# Altium schematic sheet led_ext_board.SchDoc
size A3
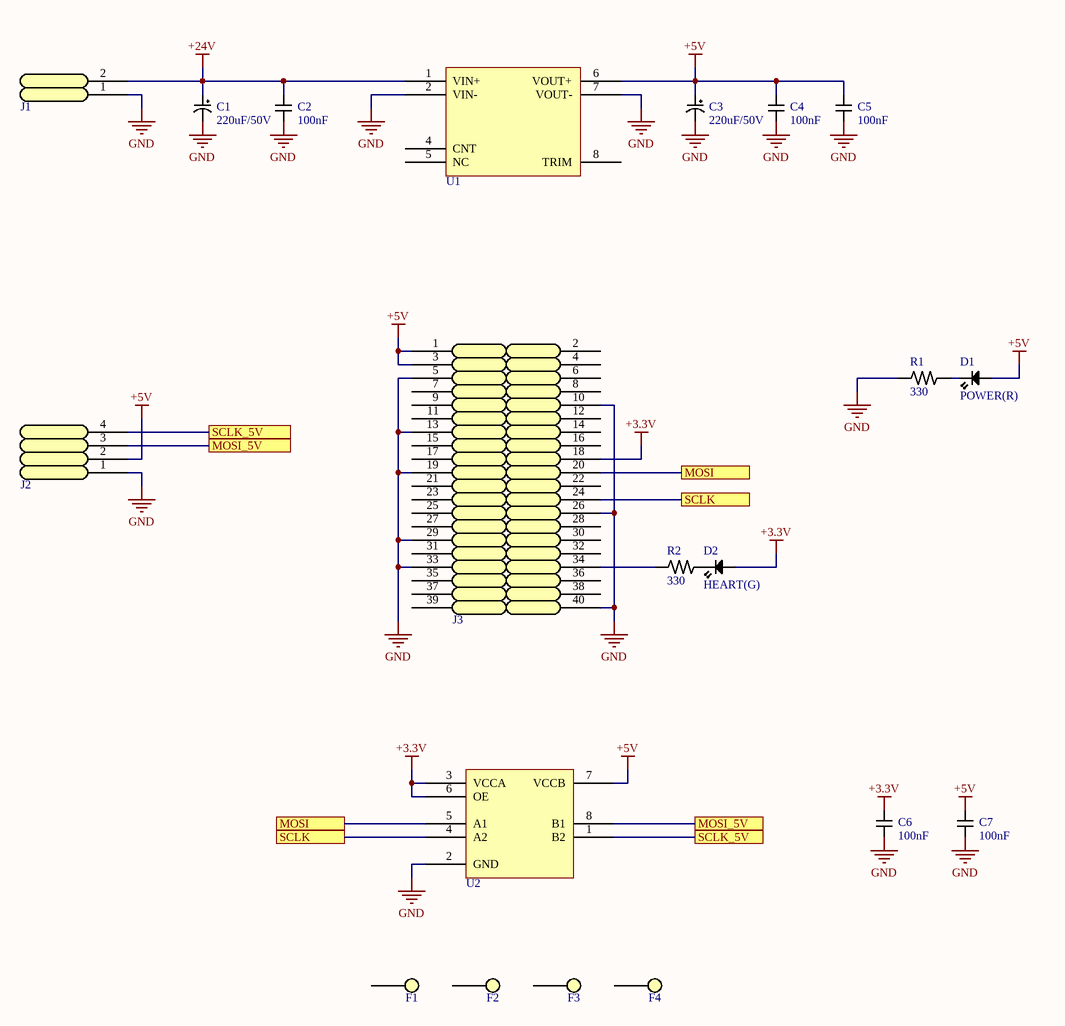
[diagram p0: led_ext_board.SchDoc]

## Parts
C1  value 220uF/50V  [EC-J10-10X10]  (hidden comment: EC)
C2  value 100nF  [CAP1608L]  (hidden comment: C)
C3  value 220uF/50V  [EC-J10-10X10]  (hidden comment: EC)
C4  value 100nF  [CAP1608L]  (hidden comment: C)
C5  value 100nF  [CAP1608L]  (hidden comment: C)
C6  value 100nF  [CAP1608L]  (hidden comment: C)
C7  value 100nF  [CAP1608L]  (hidden comment: C)
D1  value POWER(R)  [LED1608L]  (hidden comment: LED)
D2  value HEART(G)  [LED1608L]  (hidden comment: LED)
F1  FIXED_HOLE  [FIXED_HOLE_PAD]  (value not drawn)
F2  FIXED_HOLE  [FIXED_HOLE_PAD]  (value not drawn)
F3  FIXED_HOLE  [FIXED_HOLE_PAD]  (value not drawn)
F4  FIXED_HOLE  [FIXED_HOLE_PAD]  (value not drawn)
J1  CON2  [DG128-5.0-02P]  (value not drawn)
J2  CON4  [DG128-5.0-04P]  (value not drawn)
J3  CON2X20  [HS-2X20-2.54-V]  (value not drawn)
R1  value 330  [RES1608L]  (hidden comment: R)
R2  value 330  [RES1608L]  (hidden comment: R)
U1  PBR50 Series DC-DC Converter  [PBR50-24-5]  (value not drawn)
U2  TXB0102  [TXB0102]  (value not drawn)

## Ports
MOSI, MOSI_5V, SCLK, SCLK_5V

## Nets
+3.3V: C6.1 D2.2 J3.18 U2.3(VCCA) U2.6(OE)
+5V: C3.1 C4.1 C5.1 C7.1 D1.2 J2.2 J3.1 J3.3 U1.6(VOUT+) U2.7(VCCB)
+24V: C1.1 C2.1 J1.2 U1.1(VIN+)
GND: C1.2 C2.2 C3.2 C4.2 C5.2 C6.2 C7.2 J1.1 J2.1 J3.5 J3.10 J3.13 J3.19 J3.26 J3.29 J3.33 J3.40 R1.1 U1.2(VIN-) U1.7(VOUT-) U2.2(GND)
MOSI: J3.20 U2.5(A1) ; port MOSI
MOSI_5V: J2.3 U2.8(B1) ; port MOSI_5V
SCLK: J3.24 U2.4(A2) ; port SCLK
SCLK_5V: J2.4 U2.1(B2) ; port SCLK_5V
NetD1_1: D1.1 R1.2
NetJ3_34: J3.34 R2.1

Not connected (* = marked no-connect by the designer): D2 1; F1 1; F2 1; F3 1; F4 1; J3 2 4 6 7 8 9 11 12 14 15 16 17 21 22 23 25 27 28 30 31 32 35 36 37 38 39; R2 2; U1 4(CNT) 5(NC) 8(TRIM)

## Library data of the parts
C1 C3 = EC: Polarized Capacitor
C2 C4-C7 = C: Non-polarized Capacitor
D1 D2 = LED: Typical LED
J2 = CON4: Generic Connector 4 Pin
J3 = CON2X20: Generic Connector 2X20
R1 R2 = R: Resistor
U1 = PBR50